# EAGLE design test-board (EAGLE 9.6.2)
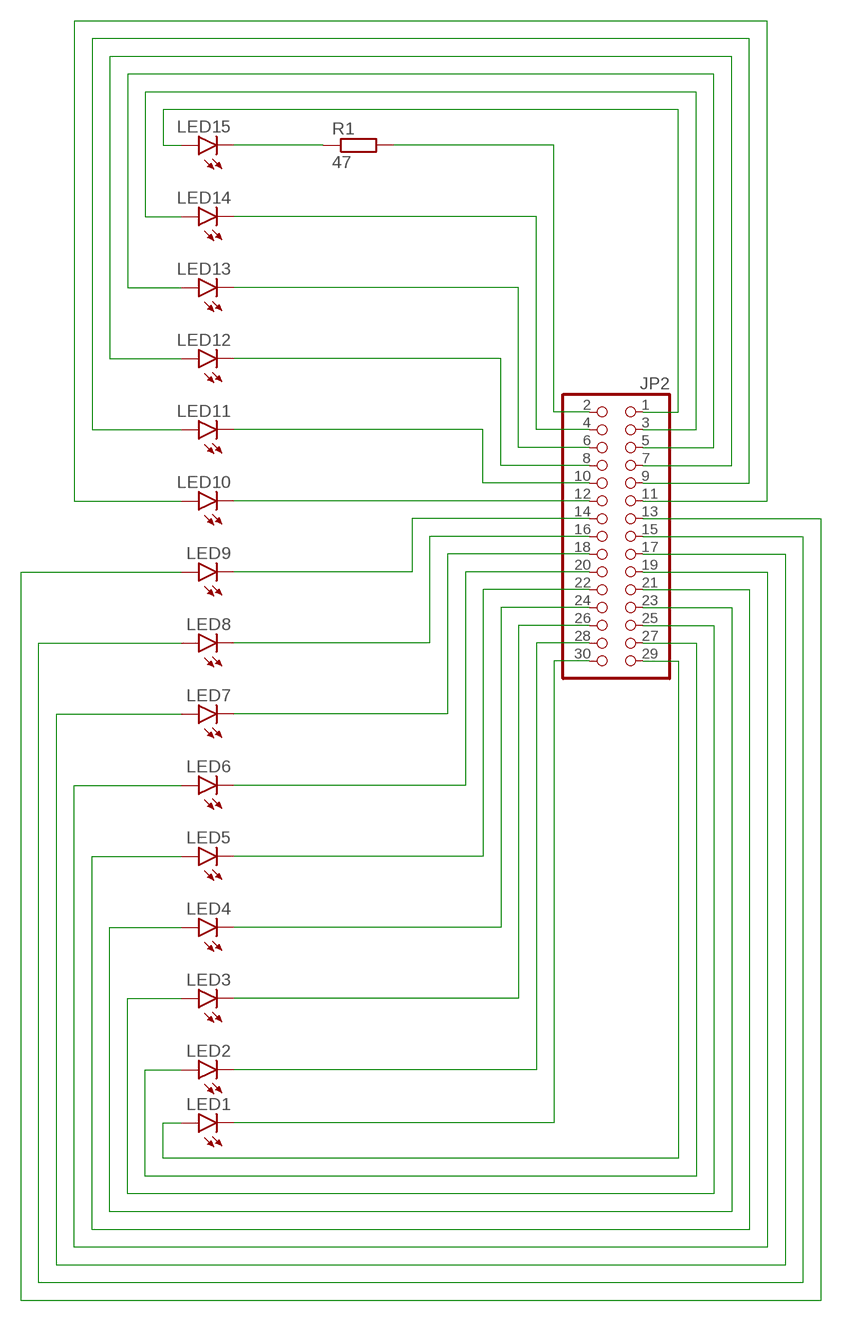
[diagram p0: schematic, sheet 1]

## Parts
JP2  PINHD-2X15  [2X15]
LED1  LED5MM  [LED5MM]
LED2  LED5MM  [LED5MM]
LED3  LED5MM  [LED5MM]
LED4  LED5MM  [LED5MM]
LED5  LED5MM  [LED5MM]
LED6  LED5MM  [LED5MM]
LED7  LED5MM  [LED5MM]
LED8  LED5MM  [LED5MM]
LED9  LED5MM  [LED5MM]
LED10  LED5MM  [LED5MM]
LED11  LED5MM  [LED5MM]
LED12  LED5MM  [LED5MM]
LED13  LED5MM  [LED5MM]
LED14  LED5MM  [LED5MM]
LED15  LED5MM  [LED5MM]
R1  47  R-EU_0207/10  [0207/10]

## Nets
N$1: JP2.2 R1.2
N$2: JP2.4 LED14.K(C)
N$3: JP2.6 LED13.K(C)
N$4: JP2.8 LED12.K(C)
N$5: JP2.10 LED11.K(C)
N$6: JP2.12 LED10.K(C)
N$7: JP2.30 LED1.K(C)
N$8: JP2.28 LED2.K(C)
N$9: JP2.26 LED3.K(C)
N$10: JP2.24 LED4.K(C)
N$11: JP2.22 LED5.K(C)
N$12: JP2.20 LED6.K(C)
N$13: JP2.18 LED7.K(C)
N$14: JP2.16 LED8.K(C)
N$15: JP2.14 LED9.K(C)
N$16: JP2.1 LED15.A
N$17: JP2.3 LED14.A
N$18: JP2.5 LED13.A
N$19: JP2.7 LED12.A
N$20: JP2.9 LED11.A
N$21: JP2.11 LED10.A
N$22: JP2.29 LED1.A
N$23: JP2.27 LED2.A
N$24: JP2.25 LED3.A
N$25: JP2.23 LED4.A
N$26: JP2.21 LED5.A
N$27: JP2.19 LED6.A
N$28: JP2.17 LED7.A
N$29: JP2.15 LED8.A
N$30: JP2.13 LED9.A
N$32: LED15.K(C) R1.1

## Library data of the parts
JP2 = pinhead:PINHD-2X15: PIN HEADER
LED1-LED15 = led:LED: LED OSRAM: - CHIPLED LG R971, LG N971, LY N971, LG Q971, LY Q971, LO R971, LY R971 LH N974, LH R974 LS Q976, LO Q976, LY Q976 LO Q996 - Hyper CHIPLED LW Q18S LB Q993, LB Q99A, LB R99A - SideLED LS A670, LO A670, LY A670, LG A670, LP A670 LB A673, LV A673, LT A673, LW A673 LH A674 LY A675 LS A676, LA A676, LO A676, LY A676, LW A676 LS A679, LY A679, LG A679 - Hyper Micro SIDELED® LS Y876, LA Y876, LO Y876, LY Y876 LT Y87S - SmartLED LW L88C, LW L88S LB L89C, LB L89S, LG L890 LS L89K, LO L89K, LY L89K LS L896, LA L896, LO L896, LY L896 - TOPLED LS T670, LO T670, LY T670, LG T670, LP T670 LSG T670, LSP T670, LSY T670, LOP T670, LYG T670 LG T671, LOG T671, LSG T671 LB T673, LV T673, LT T673, LW T673 LH T674 LS T676, LA T676, LO T676, LY T676, LB T676, LH T676, LSB T676, LW T676 LB T67C, LV T67C, LT T67C, LS T67K, LO T67K, LY T67K, LW E67C LS E67B, LA E67B, LO E67B, LY E67B, LB E67C, LV E67C, LT E67C LW T67C LS T679, LY T679, LG T679 LS T770, LO T770, LY T770, LG T770, LP T770 LB T773, LV T773, LT T773, LW T773 LH T774 LS E675, LA E675, LY E675, LS T675 LS T776, LA T776, LO T776, LY T776, LB T776 LHGB T686 LT T68C, LB T68C - Hyper Mini TOPLED® LB M676 - Mini TOPLED Santana® LG M470 LS M47K, LO M47K, LY M47K Source: http://www.osram.convergy.de LUXEON: - LUMILED® LXK2-PW12-R00, LXK2-PW12-S00, LXK2-PW14-U00, LXK2-PW14-V00 LXK2-PM12-R00, LXK2-PM12-S00, LXK2-PM14-U00 LXK2-PE12-Q00, LXK2-PE12-R00, LXK2-PE12-S00, LXK2-PE14-T00, LXK2-PE14-U00 LXK2-PB12-K00, LXK2-PB12-L00, LXK2-PB12-M00, LXK2-PB14-N00, LXK2-PB14-P00, LXK2-PB14-Q00 LXK2-PR12-L00, LXK2-PR12-M00, LXK2-PR14-Q00, LXK2-PR14-R00 LXK2-PD12-Q00, LXK2-PD12-R00, LXK2-PD12-S00 LXK2-PH12-R00, LXK2-PH12-S00 LXK2-PL12-P00, LXK2-PL12-Q00, LXK2-PL12-R00 Source: www.luxeon.com KINGBRIGHT: KA-3528ASYC Source: www.kingbright.com
R1 = rcl:R-EU_: RESISTOR, European symbol; SPICEPREFIX: R

## Board
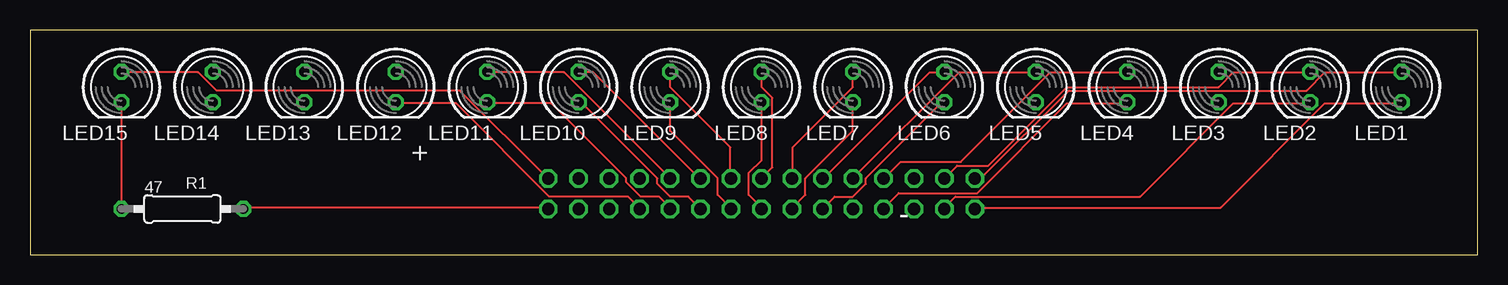
[diagram p1: board, top side]
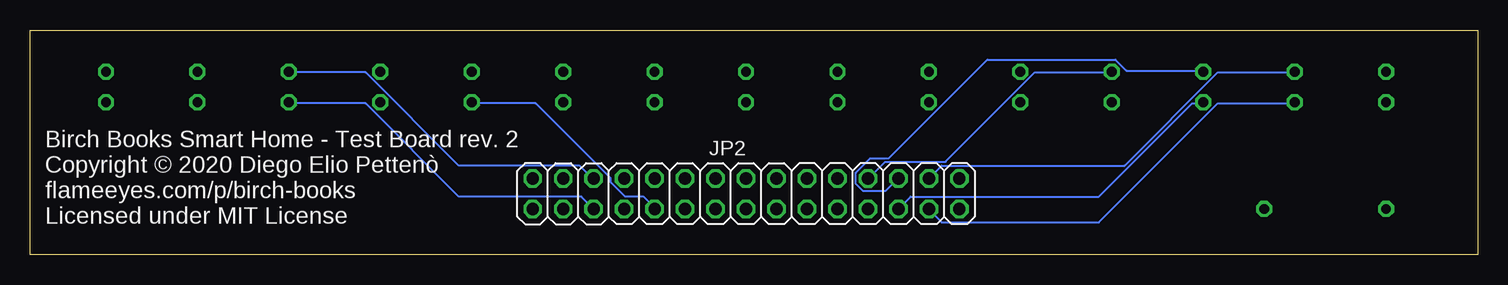
[diagram p2: board, bottom side, seen from below]

Size 120.63 x 18.72 mm. Coordinates in mm from the lower left corner, seen from the top.
Outline: 0,0 120.63,0 120.63,18.72 0,18.72 0,0
Copper layers (1*16): Top 0.035mm / dielectric 1.5mm / Bottom 0.035mm
Design rules "default": minimum track width 6mil, minimum drill 0.35mm, track to track 6mil, track to pad 6mil, pad to pad 6mil, via to via 6mil, smd to smd 6mil, copper to edge 40mil, drill to drill 6mil, minimum pad ring 10mil, minimum via ring 8mil, stop-mask expansion 4mil, vias tented up to drill 0mil, thermal gap 10mil

### Footprints (pad centres in the part's own frame; a part is rotated, then mirrored left to right if it is on the bottom)
2X15 = drill 1.016 octagon: 1 -17.78,-1.27; 2 -17.78,1.27; 3 -15.24,-1.27; 4 -15.24,1.27; 5 -12.7,-1.27; 6 -12.7,1.27; 7 -10.16,-1.27; 8 -10.16,1.27; 9 -7.62,-1.27; 10 -7.62,1.27; 11 -5.08,-1.27; 12 -5.08,1.27; 13 -2.54,-1.27; 14 -2.54,1.27; 15 0,-1.27; 16 0,1.27; 17 2.54,-1.27; 18 2.54,1.27; 19 5.08,-1.27; 20 5.08,1.27; 21 7.62,-1.27; 22 7.62,1.27; 23 10.16,-1.27; 24 10.16,1.27; 25 12.7,-1.27; 26 12.7,1.27; 27 15.24,-1.27; 28 15.24,1.27; 29 17.78,-1.27; 30 17.78,1.27
LED5MM = drill 0.813 octagon: A -1.27,0; K 1.27,0
0207/10 = drill 0.813 octagon: 1 -5.08,0; 2 5.08,0

### Placement (x,y rotation side)
JP2  60.96,5.08 180 bottom
LED1  114.3,13.97 270 top
LED2  106.68,13.97 270 top
LED3  99.06,13.97 270 top
LED4  91.44,13.97 270 top
LED5  83.82,13.97 270 top
LED6  76.2,13.97 270 top
LED7  68.58,13.97 270 top
LED8  60.96,13.97 270 top
LED9  53.34,13.97 270 top
LED10  45.72,13.97 270 top
LED11  38.1,13.97 270 top
LED12  30.48,13.97 270 top
LED13  22.86,13.97 270 top
LED14  15.24,13.97 270 top
LED15  7.62,13.97 270 top
R1  12.7,3.81 0 top

### Tracks (layer width: path | path; a pad name or v marks a point on that pad's centre or on a via)
N$1
  Top 0.152: R1.2 17.83,3.91 43.13,3.91 JP2.2
N$2
  Bottom 0.152: LED14.K 15.24,12.6 21.64,12.6 31.55,2.69 44.65,2.69 45.72,3.76 JP2.4
N$3
  Bottom 0.152: JP2.6 47.24,4.83 31.55,4.83 23.77,12.6 22.86,12.6 LED13.K
N$4
  Top 0.152: LED12.K 30.48,12.6 35.51,12.6 43.28,4.83 49.84,4.83 50.75,3.91 JP2.8
N$5
  Top 0.152: LED11.K 38.1,12.6 43.43,12.6 49.68,6.35 49.68,6.04 50.9,4.83 52.43,4.83 53.34,3.91 JP2.10
N$6
  Top 0.152: JP2.12 54.86,4.83 53.34,4.83 52.27,5.89 52.27,6.35 46.02,12.6 45.72,12.6 LED10.K
N$7
  Top 0.152: LED1.K 114.3,12.6 107.9,12.6 99.21,3.91 78.79,3.91 JP2.30
N$8
  Top 0.152: LED2.K 106.68,12.6 100.28,12.6 92.51,4.83 77.11,4.83 76.2,3.91 JP2.28
N$9
  Bottom 0.152: JP2.26 74.68,4.83 84.89,4.83 92.66,12.6 99.06,12.6 LED3.K
N$10
  Top 0.152: LED4.K 91.44,12.6 86.41,12.6 78.94,5.13 72.39,5.13 71.17,3.91 JP2.24
N$11
  Bottom 0.152: LED5.K 83.82,12.6 78.49,12.6 72.24,6.35 72.24,6.04 71.02,4.83 69.49,4.83 68.58,3.91 JP2.22
N$12
  Top 0.152: JP2.20 67.06,4.83 68.58,4.83 69.65,5.89 69.65,6.35 75.89,12.6 76.2,12.6 LED6.K
N$13
  Top 0.152: LED7.K 68.58,10.31 64.62,6.35 64.62,4.98 63.55,3.91 JP2.18
N$14
  Top 0.152: LED8.K 60.96,7.87 59.89,6.81 59.89,4.98 60.96,3.91 JP2.16
N$15
  Top 0.152: LED9.K 53.34,10.31 57.3,6.35 57.3,4.98 58.37,3.91 JP2.14
N$16
  Top 0.152: LED15.A 7.62,15.19 14.02,15.19 15.54,13.66 35.81,13.66 43.13,6.35 JP2.1
N$17
  Bottom 0.152: JP2.3 44.65,7.42 29.41,7.42 21.64,15.19 15.24,15.19 LED14.A
N$18
  Bottom 0.152: LED13.A 22.86,15.34 29.26,15.34 30.18,16.26 40.84,16.26 49.07,8.03 50.6,8.03 51.82,6.81 51.82,5.89 51.21,5.28 49.38,5.28 48.31,6.35 JP2.5
N$19
  Bottom 0.152: LED12.A 30.48,15.19 36.88,15.19 44.35,7.72 49.38,7.72 50.75,6.35 JP2.7
N$20
  Top 0.152: JP2.9 44.5,15.19 38.1,15.19 LED11.A
N$21
  Top 0.152: LED10.A 45.72,15.19 46.94,15.19 55.78,6.35 JP2.11
N$22
  Top 0.152: JP2.29 79.25,6.35 86.56,13.66 106.38,13.66 107.9,15.19 114.3,15.19 LED1.A
N$23
  Top 0.152: JP2.27 77.27,7.42 79.86,7.42 86.41,13.97 99.06,13.97 100.28,15.19 106.68,15.19 LED2.A
N$24
  Bottom 0.152: LED3.A 99.06,15.19 92.66,15.19 84.89,7.42 74.83,7.42 73.76,6.35 JP2.25
N$25
  Top 0.152: LED4.A 91.44,15.19 85.04,15.19 77.57,7.72 72.54,7.72 71.17,6.35 JP2.23
N$26
  Top 0.152: JP2.21 77.42,15.19 83.82,15.19 LED5.A
N$27
  Top 0.152: LED6.A 76.2,15.19 74.98,15.19 66.14,6.35 JP2.19
N$28
  Top 0.152: LED7.A 68.58,13.97 63.55,8.94 63.55,6.35 JP2.17
N$29
  Top 0.152: LED8.A 60.96,13.97 61.87,13.06 61.87,7.26 JP2.15
N$30
  Top 0.152: LED9.A 53.34,13.97 58.37,8.94 58.37,6.35 JP2.13
N$32
  Top 0.152: LED15.K R1.1

### Text on the board
tPlace: + | -
bPlace: Birch Books Smart Home - Test Board rev. 2 / Copyright © 2020 Diego Elio Pettenò / flameeyes.com/p/birch-books / Licensed under MIT License